# Altium project Cabinet.PrjPCB (part 1 of 2)
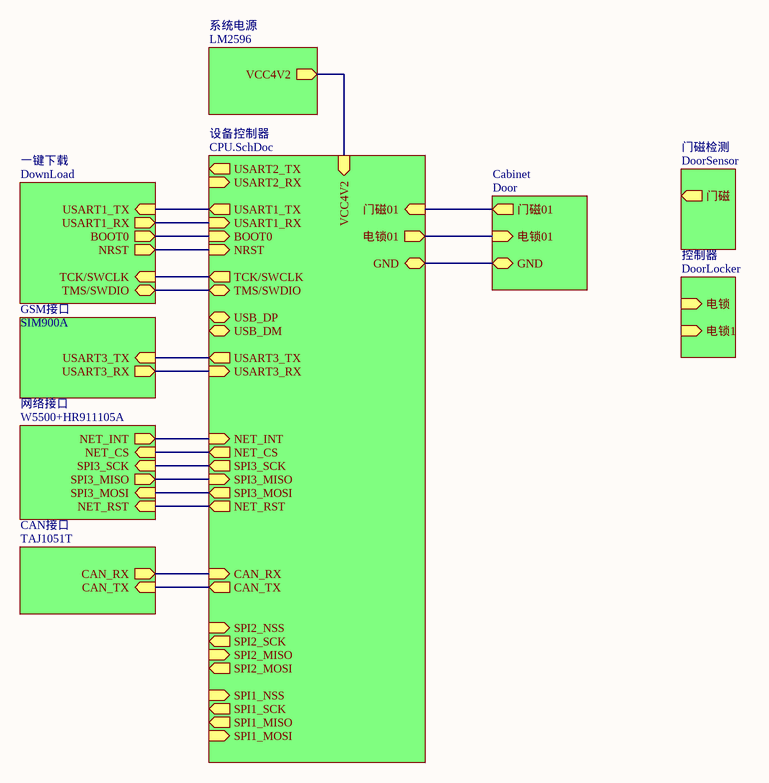
[diagram p0: Cabinet_device.SchDoc]
9 sheets, 160 parts. Net scope: hierarchical (ports join the sheet entries above them; power ports are global).
Sheets:
  Cabinet_device.SchDoc
    设备控制器 = CPU.SchDoc
    CAN接口 = TAJ1051T.SchDoc
    GSM接口 = SIM900A.SchDoc
    控制器 = DoorLocker.SchDoc
    网络接口 = W5500+HR911105A.SchDoc
    一键下载 = DownLoad.SchDoc
    系统电源 = LM2596.SchDoc
    Cabinet = Door.SchDoc

## Sheet Cabinet_device.SchDoc
size A4

### Sub-sheets
Cabinet = Door: 门磁01 (out), 电锁01 (in), GND
CAN接口 = TAJ1051T: CAN_RX (out), CAN_TX (in)
GSM接口 = SIM900A: USART3_RX (out), USART3_TX (in)
一键下载 = DownLoad: BOOT0 (out), NRST (out), USART1_TX (in), USART1_RX (out), TCK/SWCLK (in), TMS/SWDIO (bidir)
控制器 = DoorLocker: 电锁 (in), 电锁1 (in)
系统电源 = LM2596: VCC4V2 (out)
网络接口 = W5500+HR911105A: NET_CS (in), SPI3_MISO (out), SPI3_MOSI (in), SPI3_SCK (in), NET_RST (in), NET_INT (out)
设备控制器 = CPU.SchDoc: CAN_TX (out), CAN_RX (in), USART3_TX (out), USART3_RX (in), USART2_TX (out), USART2_RX (in), SPI1_NSS (in), SPI1_SCK (out), SPI1_MISO (out), SPI1_MOSI (in), USART1_TX (out), USART1_RX (in), 门磁01 (in), NET_CS (out), SPI2_SCK (out), SPI2_MISO (in), SPI2_MOSI (out), NET_RST (out), NET_INT (in), 电锁01 (out), USB_DM, USB_DP, TCK/SWCLK (out), TMS/SWDIO (bidir), VCC4V2 (in), BOOT0 (in), NRST (in), SPI3_SCK (out), SPI3_MISO (in), SPI3_MOSI (out), SPI2_NSS (in), GND
门磁检测 = DoorSensor (file not in this document): 门磁 (out)

### Nets
CAN_RX: sheet 设备控制器/CAN_RX, sheet CAN接口/CAN_RX
CAN_TX: sheet 设备控制器/CAN_TX, sheet CAN接口/CAN_TX
~{NRST}: sheet 设备控制器/NRST, sheet 一键下载/NRST
NetR28_1: sheet 设备控制器/NET_RST, sheet 网络接口/NET_RST
NetR29_2: sheet 设备控制器/NET_INT, sheet 网络接口/NET_INT
NetR30_2: sheet 设备控制器/NET_CS, sheet 网络接口/NET_CS
NetR52_1: sheet 设备控制器/BOOT0, sheet 一键下载/BOOT0
NetU7_16: sheet 设备控制器/门磁01, sheet Cabinet/门磁01
NetU7_47: sheet 设备控制器/USART3_TX, sheet GSM接口/USART3_TX
NetU7_48: sheet 设备控制器/USART3_RX, sheet GSM接口/USART3_RX
NetU7_68: sheet 设备控制器/USART1_TX, sheet 一键下载/USART1_TX
NetU7_69: sheet 设备控制器/USART1_RX, sheet 一键下载/USART1_RX
NetU7_72: sheet 设备控制器/TMS/SWDIO, sheet 一键下载/TMS/SWDIO
NetU7_76: sheet 设备控制器/TCK/SWCLK, sheet 一键下载/TCK/SWCLK
NetU7_82: sheet 设备控制器/电锁01, sheet Cabinet/电锁01
NetU7_89: sheet 设备控制器/SPI3_SCK, sheet 网络接口/SPI3_SCK
NetU7_90: sheet 设备控制器/SPI3_MISO, sheet 网络接口/SPI3_MISO
NetU7_91: sheet 设备控制器/SPI3_MOSI, sheet 网络接口/SPI3_MOSI
(unnamed): sheet 设备控制器/VCC4V2, sheet 系统电源/VCC4V2
(unnamed): sheet 设备控制器/GND, sheet Cabinet/GND

## Sheet CPU.SchDoc
size A3
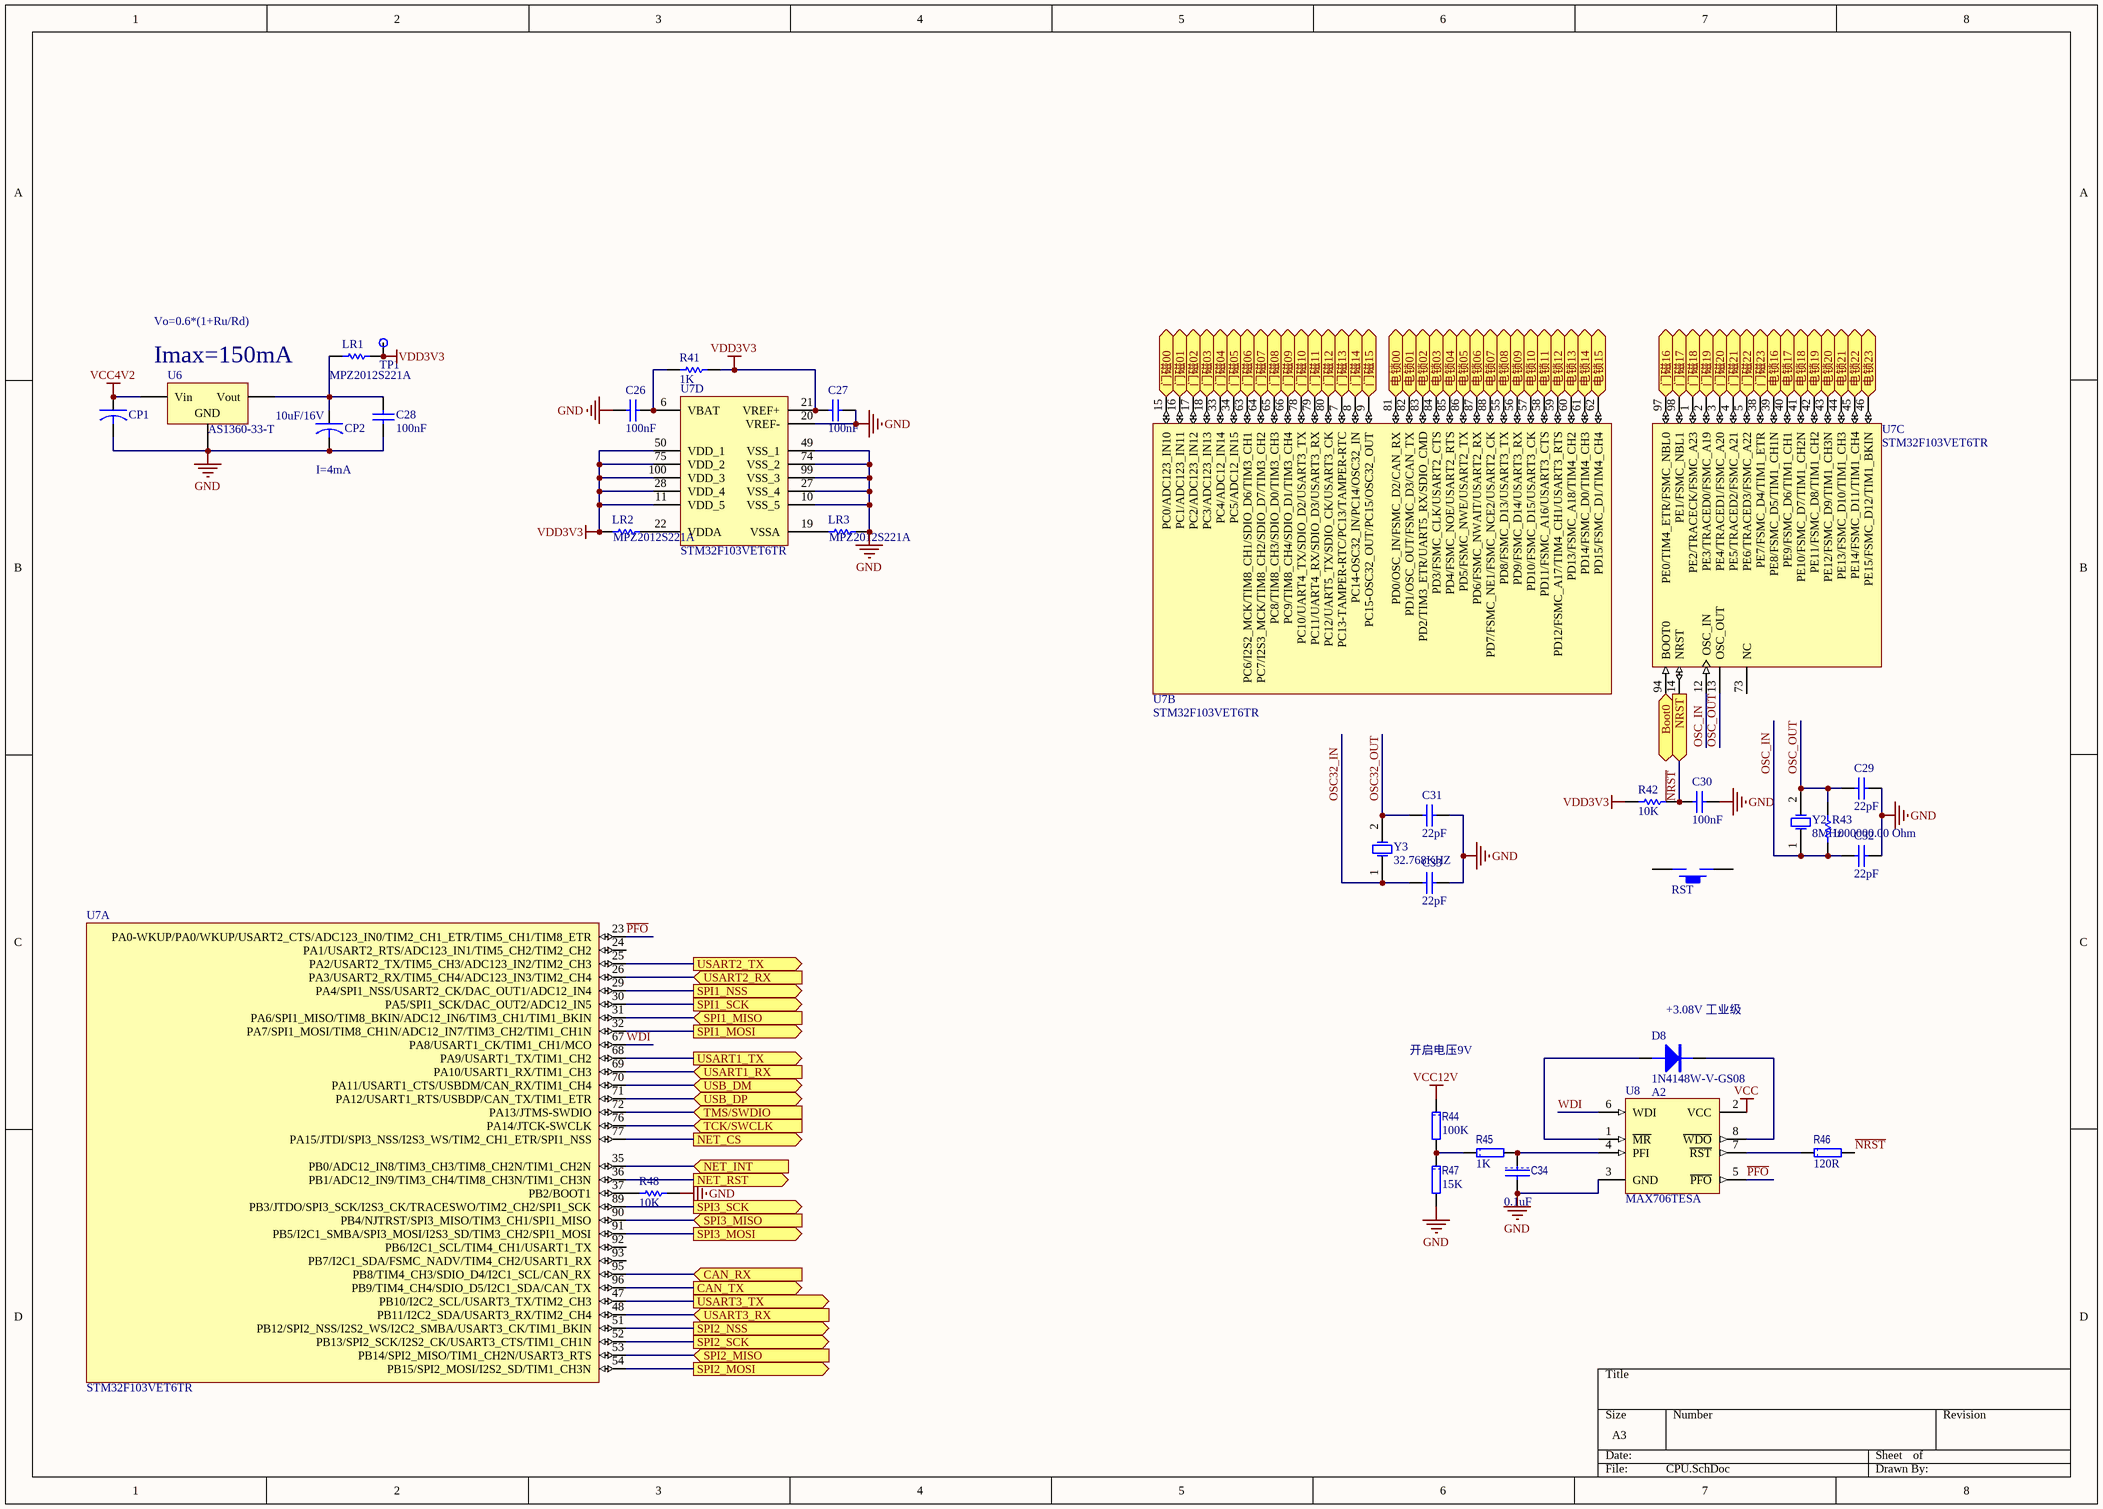
[diagram p1: CPU.SchDoc]

### Parts
(Parts that share a designator on the sheet are numbered #1, #2 ... from top to bottom, then left to right.)
C26  value 100nF  [CAPC0805(2012)100_L]  (hidden comment: CAP 100nF 50V 0805(2012))
C27  value 100nF  [CAPC0805(2012)100_L]  (hidden comment: CAP 100nF 50V 0805(2012))
C28  value 100nF  [CAPC0805(2012)100_L]  (hidden comment: CAP 100nF 50V 0805(2012))
C29  value 22pF  [CAPC0805(2012)75_M]  (hidden comment: CAP 22pF 50V 0805(2012))
C30  value 100nF  [CAPC0805(2012)145_N]  (hidden comment: CAP 100nF 50V 0805(2012))
C31  value 22pF  [CAPC0805(2012)75_M]  (hidden comment: CAP 22pF 50V 0805(2012))
C32  value 22pF  [CAPC0805(2012)75_M]  (hidden comment: CAP 22pF 50V 0805(2012))
C33  value 22pF  [CAPC0805(2012)75_M]  (hidden comment: CAP 22pF 50V 0805(2012))
C34  value 0.1uF  [1608[0603]C]  (hidden comment: C1608X7R1H104K)
CP1  TAJA106K016RNJ  [3216[1206]CB]  (value not drawn)
CP2  value 10uF/16V  [3216[1206]CB]  (hidden comment: TAJA106K016RNJ)
D8  1N4148W-V-GS08  value A2  [SOD123]
LR1  MPZ2012S221A  [2012[0805]]
LR2  MPZ2012S221A  [2012[0805]]
LR3  MPZ2012S221A  [2012[0805]]
R41  value 1K  [RESC0805(2012)_M]  (hidden comment: 1K 1% 0805(2012))
R42  value 10K  [RESC0805(2012)_M]  (hidden comment: 10K 1% 0805(2012))
R43  value 1000000.00 Ohm  [RESC0805(2012)_N]  (hidden comment: 1M 1% 0805(2012))
R44  value 100K  [1608[0603]R]  (hidden comment: CRCW0603100KFKEA)
R45  value 1K  [1608[0603]R]  (hidden comment: CRCW06031K00FKEA)
R46  value 120R  [1608[0603]R]  (hidden comment: CRCW0603120RFKEA)
R47  value 15K  [1608[0603]R]  (hidden comment: CRCW060315K0FKEA)
R48  value 10K  [RESC0805(2012)_M]  (hidden comment: 10K 1% 0805(2012))
RST  KEY_M  [KEY_M]  (value not drawn)
TP1  TP  [TP]  (value not drawn)
U6  AS1360-33-T  [SOT23_N]
U7  STM32F103VET6TR  [STM-LQFP100_M]  (parts A,B,C,D of 4)
U8#1  MAX706TESA  [NSO8_N]
Y2  8MHz  [XTAL_US]
Y3  32.768KHZ  [XTAL32_1]

### Ports
Boot0 (in), CAN_RX (in), CAN_TX (out), NET_CS (out), NET_INT (in), NET_RST (out), NRST (in), SPI1_MISO (in), SPI1_MOSI (out), SPI1_NSS (out), SPI1_SCK (out), SPI2_MISO (in), SPI2_MOSI (out), SPI2_NSS (out), SPI2_SCK (out), SPI3_MISO (in), SPI3_MOSI (out), SPI3_SCK (out), TCK/SWCLK (in), TMS/SWDIO (in), USART1_RX (in), USART1_TX (out), USART2_RX (in), USART2_TX (out), USART3_RX (in), USART3_TX (out), USB_DM (bidir), USB_DP (bidir), 电锁00 (out), 电锁01 (out), 电锁02 (out), 电锁03 (out), 电锁04 (out), 电锁05 (out), 电锁06 (out), 电锁07 (out), 电锁08 (out), 电锁09 (out), 电锁10 (out), 电锁11 (out), 电锁12 (out), 电锁13 (out), 电锁14 (out), 电锁15 (out), 电锁16 (out), 电锁17 (out), 电锁18 (out), 电锁19 (out), 电锁20 (out), 电锁21 (out), 电锁22 (out), 电锁23 (out), 门磁00 (in), 门磁01 (in), 门磁02 (in), 门磁03 (in), 门磁04 (in), 门磁05 (in), 门磁06 (in), 门磁07 (in), 门磁08 (in), 门磁09 (in), 门磁10 (in), 门磁11 (in), 门磁12 (in), 门磁13 (in), 门磁14 (in), 门磁15 (in), 门磁16 (in), 门磁17 (in), 门磁18 (in), 门磁19 (in), 门磁20 (in), 门磁21 (in), 门磁22 (in), 门磁23 (in)

### Nets
GND: C26.2 C27.2 C28.1 C29.1 C30.1 C31.1 C32.1 C33.1 C34.2 CP1.2 CP2.2 LR3.2 R47.2 R48.1 U6.1(GND) U7.10(VSS_5) U7.20(VREF-) U7.27(VSS_4) U7.49(VSS_1) U7.74(VSS_2) U7.99(VSS_3) U8#1.3(GND)
VCC: U8#1.2(VCC)
VCC4V2: CP1.1 U6.3(Vin)
VCC12V: R44.1
VDD3V3: C27.1 LR1.1 LR2.1 R41.1 R42.2 TP1.1(TestPoint) U7.11(VDD_5) U7.21(VREF+) U7.28(VDD_4) U7.50(VDD_1) U7.75(VDD_2) U7.100(VDD_3)
CAN_RX: U7.95(PB8/TIM4_CH3/SDIO_D4/I2C1_SCL/CAN_RX) ; port CAN_RX
CAN_TX: U7.96(PB9/TIM4_CH4/SDIO_D5/I2C1_SDA/CAN_TX) ; port CAN_TX
~{NRST}: C30.2 R42.1 R46.2 U7.14(NRST) ; port NRST
OSC32_IN: C33.2 Y3.1(OSC1)
OSC32_OUT: C31.2 Y3.2(OSC2)
OSC_IN: C32.2 R43.1 U7.12(OSC_IN) Y2.1(OSC1)
OSC_OUT: C29.2 R43.2 U7.13(OSC_OUT) Y2.2(OSC2)
~{PFO}: U7.23(PA0-WKUP/PA0/WKUP/USART2_CTS/ADC123_IN0/TIM2_CH1_ETR/TIM5_CH1/TIM8_ETR) U8#1.5(~{PFO})
WDI: U7.67(PA8/USART1_CK/TIM1_CH1/MCO) U8#1.6(WDI)
NetC26_1: C26.1 R41.2 U7.6(VBAT)
NetC28_2: C28.2 CP2.1 LR1.2 U6.2(Vout)
NetC34_1: C34.1 R45.2 U8#1.4(PFI)
NetD8_1: D8.1(A) U8#1.1(~{MR})
NetD8_2: D8.2(K) U8#1.8(~{WDO})
NetLR2_2: LR2.2 U7.22(VDDA)
NetLR3_1: LR3.1 U7.19(VSSA)
NetR28_1: U7.36(PB1/ADC12_IN9/TIM3_CH4/TIM8_CH3N/TIM1_CH3N) ; port NET_RST
NetR29_2: U7.35(PB0/ADC12_IN8/TIM3_CH3/TIM8_CH2N/TIM1_CH2N) ; port NET_INT
NetR30_2: U7.77(PA15/JTDI/SPI3_NSS/I2S3_WS/TIM2_CH1_ETR/SPI1_NSS) ; port NET_CS
NetR44_2: R44.2 R45.1 R47.1
NetR46_1: R46.1 U8#1.7(~{RST})
NetR48_2: R48.2 U7.37(PB2/BOOT1)
NetR52_1: U7.94(BOOT0) ; port Boot0
NetU7_1: U7.1(PE2/TRACECK/FSMC_A23) ; port 门磁18
NetU7_2: U7.2(PE3/TRACED0/FSMC_A19) ; port 门磁19
NetU7_3: U7.3(PE4/TRACED1/FSMC_A20) ; port 门磁20
NetU7_4: U7.4(PE5/TRACED2/FSMC_A21) ; port 门磁21
NetU7_5: U7.5(PE6/TRACED3/FSMC_A22) ; port 门磁22
NetU7_7: U7.7(PC13-TAMPER-RTC/PC13/TAMPER-RTC) ; port 门磁13
NetU7_8: U7.8(PC14-OSC32_IN/PC14/OSC32_IN) ; port 门磁14
NetU7_9: U7.9(PC15-OSC32_OUT/PC15/OSC32_OUT) ; port 门磁15
NetU7_15: U7.15(PC0/ADC123_IN10) ; port 门磁00
NetU7_16: U7.16(PC1/ADC123_IN11) ; port 门磁01
NetU7_17: U7.17(PC2/ADC123_IN12) ; port 门磁02
NetU7_18: U7.18(PC3/ADC123_IN13) ; port 门磁03
NetU7_25: U7.25(PA2/USART2_TX/TIM5_CH3/ADC123_IN2/TIM2_CH3) ; port USART2_TX
NetU7_26: U7.26(PA3/USART2_RX/TIM5_CH4/ADC123_IN3/TIM2_CH4) ; port USART2_RX
NetU7_29: U7.29(PA4/SPI1_NSS/USART2_CK/DAC_OUT1/ADC12_IN4) ; port SPI1_NSS
NetU7_30: U7.30(PA5/SPI1_SCK/DAC_OUT2/ADC12_IN5) ; port SPI1_SCK
NetU7_31: U7.31(PA6/SPI1_MISO/TIM8_BKIN/ADC12_IN6/TIM3_CH1/TIM1_BKIN) ; port SPI1_MISO
NetU7_32: U7.32(PA7/SPI1_MOSI/TIM8_CH1N/ADC12_IN7/TIM3_CH2/TIM1_CH1N) ; port SPI1_MOSI
NetU7_33: U7.33(PC4/ADC12_IN14) ; port 门磁04
NetU7_34: U7.34(PC5/ADC12_IN15) ; port 门磁05
NetU7_38: U7.38(PE7/FSMC_D4/TIM1_ETR) ; port 门磁23
NetU7_39: U7.39(PE8/FSMC_D5/TIM1_CH1N) ; port 电锁16
NetU7_40: U7.40(PE9/FSMC_D6/TIM1_CH1) ; port 电锁17
NetU7_41: U7.41(PE10/FSMC_D7/TIM1_CH2N) ; port 电锁18
NetU7_42: U7.42(PE11/FSMC_D8/TIM1_CH2) ; port 电锁19
NetU7_43: U7.43(PE12/FSMC_D9/TIM1_CH3N) ; port 电锁20
NetU7_44: U7.44(PE13/FSMC_D10/TIM1_CH3) ; port 电锁21
NetU7_45: U7.45(PE14/FSMC_D11/TIM1_CH4) ; port 电锁22
NetU7_46: U7.46(PE15/FSMC_D12/TIM1_BKIN) ; port 电锁23
NetU7_47: U7.47(PB10/I2C2_SCL/USART3_TX/TIM2_CH3) ; port USART3_TX
NetU7_48: U7.48(PB11/I2C2_SDA/USART3_RX/TIM2_CH4) ; port USART3_RX
NetU7_51: U7.51(PB12/SPI2_NSS/I2S2_WS/I2C2_SMBA/USART3_CK/TIM1_BKIN) ; port SPI2_NSS
NetU7_52: U7.52(PB13/SPI2_SCK/I2S2_CK/USART3_CTS/TIM1_CH1N) ; port SPI2_SCK
NetU7_53: U7.53(PB14/SPI2_MISO/TIM1_CH2N/USART3_RTS) ; port SPI2_MISO
NetU7_54: U7.54(PB15/SPI2_MOSI/I2S2_SD/TIM1_CH3N) ; port SPI2_MOSI
NetU7_55: U7.55(PD8/FSMC_D13/USART3_TX) ; port 电锁08
NetU7_56: U7.56(PD9/FSMC_D14/USART3_RX) ; port 电锁09
NetU7_57: U7.57(PD10/FSMC_D15/USART3_CK) ; port 电锁10
NetU7_58: U7.58(PD11/FSMC_A16/USART3_CTS) ; port 电锁11
NetU7_59: U7.59(PD12/FSMC_A17/TIM4_CH1/USART3_RTS) ; port 电锁12
NetU7_60: U7.60(PD13/FSMC_A18/TIM4_CH2) ; port 电锁13
NetU7_61: U7.61(PD14/FSMC_D0/TIM4_CH3) ; port 电锁14
NetU7_62: U7.62(PD15/FSMC_D1/TIM4_CH4) ; port 电锁15
NetU7_63: U7.63(PC6/I2S2_MCK/TIM8_CH1/SDIO_D6/TIM3_CH1) ; port 门磁06
NetU7_64: U7.64(PC7/I2S3_MCK/TIM8_CH2/SDIO_D7/TIM3_CH2) ; port 门磁07
NetU7_65: U7.65(PC8/TIM8_CH3/SDIO_D0/TIM3_CH3) ; port 门磁08
NetU7_66: U7.66(PC9/TIM8_CH4/SDIO_D1/TIM3_CH4) ; port 门磁09
NetU7_68: U7.68(PA9/USART1_TX/TIM1_CH2) ; port USART1_TX
NetU7_69: U7.69(PA10/USART1_RX/TIM1_CH3) ; port USART1_RX
NetU7_70: U7.70(PA11/USART1_CTS/USBDM/CAN_RX/TIM1_CH4) ; port USB_DM
NetU7_71: U7.71(PA12/USART1_RTS/USBDP/CAN_TX/TIM1_ETR) ; port USB_DP
NetU7_72: U7.72(PA13/JTMS-SWDIO) ; port TMS/SWDIO
NetU7_76: U7.76(PA14/JTCK-SWCLK) ; port TCK/SWCLK
NetU7_78: U7.78(PC10/UART4_TX/SDIO_D2/USART3_TX) ; port 门磁10
NetU7_79: U7.79(PC11/UART4_RX/SDIO_D3/USART3_RX) ; port 门磁11
NetU7_80: U7.80(PC12/UART5_TX/SDIO_CK/USART3_CK) ; port 门磁12
NetU7_81: U7.81(PD0/OSC_IN/FSMC_D2/CAN_RX) ; port 电锁00
NetU7_82: U7.82(PD1/OSC_OUT/FSMC_D3/CAN_TX) ; port 电锁01
NetU7_83: U7.83(PD2/TIM3_ETR/UART5_RX/SDIO_CMD) ; port 电锁02
NetU7_84: U7.84(PD3/FSMC_CLK/USART2_CTS) ; port 电锁03
NetU7_85: U7.85(PD4/FSMC_NOE/USART2_RTS) ; port 电锁04
NetU7_86: U7.86(PD5/FSMC_NWE/USART2_TX) ; port 电锁05
NetU7_87: U7.87(PD6/FSMC_NWAIT/USART2_RX) ; port 电锁06
NetU7_88: U7.88(PD7/FSMC_NE1/FSMC_NCE2/USART2_CK) ; port 电锁07
NetU7_89: U7.89(PB3/JTDO/SPI3_SCK/I2S3_CK/TRACESWO/TIM2_CH2/SPI1_SCK) ; port SPI3_SCK
NetU7_90: U7.90(PB4/NJTRST/SPI3_MISO/TIM3_CH1/SPI1_MISO) ; port SPI3_MISO
NetU7_91: U7.91(PB5/I2C1_SMBA/SPI3_MOSI/I2S3_SD/TIM3_CH2/SPI1_MOSI) ; port SPI3_MOSI
NetU7_97: U7.97(PE0/TIM4_ETR/FSMC_NBL0) ; port 门磁16
NetU7_98: U7.98(PE1/FSMC_NBL1) ; port 门磁17

Not connected (* = marked no-connect by the designer): RST 1 2; U7 24(PA1/USART2_RTS/ADC123_IN1/TIM5_CH2/TIM2_CH2) 73(NC) 92(PB6/I2C1_SCL/TIM4_CH1/USART1_TX) 93(PB7/I2C1_SDA/FSMC_NADV/TIM4_CH2/USART1_RX)

### Notes on the sheet
- (near U6) Imax=150mA
- Vo=0.6*(1+Ru/Rd)
- (near CP2) I=4mA
- 开启电压9V
- (near D8) +3.08V 工业级

### Library data of the parts
C26-C28 = CMP-1036-04418-1: CAP 100nF 50V ±5% 0805 (2012 Metric) Thickness 1mm SMD; Case-EIA: 0805; Case-Metric: 2012; Tolerance: ±5%; Max Thickness: 1 mm; Technology: SMT; Rated Voltage: 50 V
C29 C31-C33 = CMP-1036-01234-1: CAP 22pF 50V ±1% 0805 (2012 Metric) Thickness 0.75mm SMD; Case-EIA: 0805; Case-Metric: 2012; Rated Voltage: 50 V; Tolerance: ±1%; Technology: SMT; Max Thickness: 0.75 mm
C30 = CMP-1036-04417-1: CAP 100nF 50V ±5% 0805 (2012 Metric) Thickness 1.45mm SMD; Case-Metric: 2012; Case-EIA: 0805; Max Thickness: 1.45 mm; Tolerance: ±5%; Rated Voltage: 50 V; Technology: SMT
C34 = CAP: 多层陶瓷电容器MLCC - SMD/SMT 0603 0.1uF 50volts X7R 10%; Manufacturer: TDK; 产品: General Type MLCCs; 产品种类: Low & Medium Capacitance SMD Ceramic Chip Capacitors; 外壳代码 - in: 0603; 外壳代码 - mm: 1608; 封装 / 箱体: 0603 (1608 metric); 封装: Reel; 尺寸: 0.8 mm W x 1.6 mm L x 0.8 mm H; 工作温度范围: - 55 C to + 125 C; 标准包装数量: 4000; 电压额定值: 50 V; 电容-nF: 100 nF; 电容-pF: 100000 pF; 系列: C; Category: 多层陶瓷电容器MLCC - SMD/SMT; ComponentLink1Description: http://www.tdk.com/pdf/general_B11.pdf; ComponentLink1URL: http://www.tdk.com/pdf/general_B11.pdf; Description 1: 多层陶瓷电容器MLCC - SMD/SMT 0603 0.1uF 50volts X7R 10%; Manufacturer Part Number: C1608X7R1H104K; Minimum Order Quantity: 1; Pricing 1: 1=0.160, 50=0.070, 100=0.036, 500=0.019, 1000=0.013, 4000=0.010, 8000=0.009, 12000=0.008, 20000=0.007 (USD); Reeling: True; RoHS - 贸泽: Y; RoHS: RoHS Compliant; Stock 1: 224604; Supplier 1: Mouser; Supplier Part Number 1: 810-C1608X7R1H104K; 制造商: TDK; 容差: 10 %; 温度系数/代码: X7R; 电容: 0.1 uF; 端接类型: SMD/SMT
CP1 CP2 = CAPACITOR: 钽质电容器-固体SMD 16volts 10uF 10%; Manufacturer: AVX; ESR: 3 Ohms; 产品: Tantalum Solid Standard Grade - Other Various; 产品种类: SMD Tantalum Capacitors; 制造商库存号: A Case; 外壳代码 - in: 1206; 外壳代码 - mm: 3216; 封装 / 箱体: 1206 (3216 metric); 封装: Reel; 尺寸: 1.6 mm W x 3.2 mm L; 工作温度范围: - 55 C to + 125 C; 损耗因数 DF: 8; 标准包装数量: 2000; 漏泄电流: 1.6 uA; 电压额定值: 16 V; 端接类型: SMD/SMT; 系列: TAJ; 高度: 1.8 mm; Category: 钽质电容器-固体SMD; ComponentLink1Description: http://www.avx.com/docs/Catalogs/taj.pdf; ComponentLink1URL: http://www.avx.com/docs/Catalogs/taj.pdf; Description 1: 钽质电容器-固体SMD 16volts 10uF 10%; Manufacturer Part Number: TAJA106K016RNJ; Minimum Order Quantity: 1; Pricing 1: 1=0.600, 100=0.280, 200=0.250, 500=0.221, 1000=0.200, 2000=0.140, 5000=0.131, 10000=0.124, 25000=0.103 (USD); Reeling: True; RoHS - 贸泽: Y; RoHS: RoHS Compliant; Stock 1: 20335; Supplier 1: Mouser; Supplier Part Number 1: 581-TAJA106K016R; 制造商: AVX; 容差: 10 %; 电容: 10 uF
D8 = 1N4148W: 二极管 - 通用，功率，开关 100V Io/150mA; Manufacturer: Vishay Semiconductors; 配置: Single; 工作温度范围: - 65 C to + 150 C; 封装 / 箱体: SOD-123; 封装: Reel; 产品: Switching Diodes; 正向连续电流: 0.15 A; 最大浪涌电流: 0.5 A; 安装风格: SMD/SMT; 恢复时间: 4 ns; 正向电压下降: 1.2 V; 制造商: Vishay; 最大二极管电容: 4 pF; 最大工作温度: + 150 C; 最大功率耗散: 350 mW; 最大反向漏泄电流: 5 uA; 最小工作温度: - 65 C; 标准包装数量: 15000; Supplier 1: Mouser; Supplier Part Number 1: 625-1N4148W-V; Manufacturer Part Number: 1N4148W-V-GS08; RoHS: RoHS Compliant; Category: 二极管 - 通用，功率，开关; Stock 1: 404148; Pricing 1: 1=0.090, 10=0.083, 50=0.072, 100=0.068, 500=0.032, 1000=0.026, 3000=0.021, 9000=0.016, 10000=0.016, 18000=0.014 (USD); 峰值反向电压: 100 V; 产品种类: Switching Diodes; RoHS - 贸泽: Y; Minimum Order Quantity: 1; Reeling: True; ComponentLink1URL: http://www.mouser.com/ds/2/427/1n4148w--240387.pdf; ComponentLink1Description: http://www.mouser.com/ds/2/427/1n4148w--240387.pdf; Description 1: 二极管 - 通用，功率，开关 100V Io/150mA
LR1-LR3 = Res Semi: 电磁干扰滤波珠子、扼流圈和阵列 Ferrite Chip Beads; Manufacturer: TDK; 阻抗: 220 Ohms; 最大直流电流: 3 A; 最大直流电阻: 0.04 Ohms; 工作温度范围: - 55 C to + 125 C; 封装 / 箱体: 2012; 封装: Reel; 端接类型: SMD/SMT; 容差: 25 %; 产品种类: Ferrite Beads; 标准包装数量: 4000; Supplier 1: Mouser; Supplier Part Number 1: 810-MPZ2012S221A; Manufacturer Part Number: MPZ2012S221A; RoHS: RoHS Compliant; Description 1: 电磁干扰滤波珠子、扼流圈和阵列 Ferrite Chip Beads; Category: 电磁干扰滤波珠子、扼流圈和阵列; Stock 1: 26540; Pricing 1: 1=0.070, 50=0.060, 100=0.053, 500=0.040, 1000=0.035, 4000=0.031, 8000=0.029, 12000=0.025 (USD); 制造商: TDK; RoHS - 贸泽: Y; Minimum Order Quantity: 1; Reeling: True; ComponentLink1URL: http://www.mouser.com/ds/2/400/e9413_mpz-24582.pdf; ComponentLink1Description: http://www.mouser.com/ds/2/400/e9413_mpz-24582.pdf
R41 = CMP-1013-00510-1: 1K 0.125W 1% 0805 (2012 Metric)  SMD; Case-Metric: 2012; Case-EIA: 0805; Tolerance: 1 %; Power: 0.125 W; Technology: SMT
R42 R48 = CMP-1013-00623-1: 10K 0.125W 1% 0805 (2012 Metric)  SMD; Case-Metric: 2012; Case-EIA: 0805; Tolerance: 1 %; Power: 0.125 W; Technology: SMT
R43 = CMP-1013-00849-1: 1M 0.125W 1% 0805 (2012 Metric)  SMD; Case-Metric: 2012; Case-EIA: 0805; Technology: SMT; Power: 0.125 W; Tolerance: 1 %
R44 = RES: 厚膜电阻器 - SMD 1/10watt 100Kohms 1%; Manufacturer: Vishay / Dale; 尺寸: 0.85 mm W x 1.55 mm L x 0.45 mm H; 工作温度范围: - 55 C to + 155 C; 封装 / 箱体: 0603 (1608 metric); 封装: Reel; 功率额定值: 100 mW; 产品: Thick Film Resistors SMD; 系列: CRCW; 温度系数: 100 PPM / K; 端接类型: SMD/SMT; 电压额定值: 75 V; 制造商: Vishay; 产品种类: 0603 Thick Film Chip Resistors; 标准包装数量: 5000; 外壳代码 - in: 0603; 外壳代码 - mm: 1608; Supplier 1: Mouser; Supplier Part Number 1: 71-CRCW0603-100K-E3; Manufacturer Part Number: CRCW0603100KFKEA; RoHS: RoHS Compliant By Exemption; Category: 厚膜电阻器 - SMD; Stock 1: 175756; Pricing 1: 1=0.080, 10=0.013, 100=0.010, 1000=0.008, 5000=0.005, 25000=0.004, 50000=0.003 (USD); 电阻: 100 kOhms; 容差: 1 %; RoHS - 贸泽: E; Minimum Order Quantity: 1; Reeling: True; ComponentLink1URL: http://www.mouser.com/ds/2/427/dcrcwe3-109170.pdf; ComponentLink1Description: http://www.mouser.com/ds/2/427/dcrcwe3-109170.pdf; Description 1: 厚膜电阻器 - SMD 1/10watt 100Kohms 1%
R45 = RES: 厚膜电阻器 - SMD 1/10watt 1.0Kohms 1%; Manufacturer: Vishay / Dale; 尺寸: 0.85 mm W x 1.55 mm L x 0.45 mm H; 工作温度范围: - 55 C to + 155 C; 封装 / 箱体: 0603 (1608 metric); 封装: Reel; 功率额定值: 100 mW; 产品: Thick Film Resistors SMD; 电阻: 1 kOhms; 系列: CRCW; 温度系数: 100 PPM / K; 端接类型: SMD/SMT; 电压额定值: 75 V; 制造商: Vishay; 产品种类: 0603 Thick Film Chip Resistors; 标准包装数量: 5000; 外壳代码 - in: 0603; 外壳代码 - mm: 1608; Supplier 1: Mouser; Supplier Part Number 1: 71-CRCW0603-1.0K-E3; Manufacturer Part Number: CRCW06031K00FKEA; RoHS: RoHS Compliant By Exemption; Category: 厚膜电阻器 - SMD; Stock 1: 276938; Pricing 1: 1=0.080, 10=0.013, 100=0.010, 1000=0.008, 5000=0.005, 25000=0.004, 50000=0.003 (USD); 容差: 1 %; RoHS - 贸泽: E; Minimum Order Quantity: 1; Reeling: True; ComponentLink1URL: http://www.mouser.com/ds/2/427/dcrcwe3-109170.pdf; ComponentLink1Description: http://www.mouser.com/ds/2/427/dcrcwe3-109170.pdf; Description 1: 厚膜电阻器 - SMD 1/10watt 1.0Kohms 1%
R46 = RES: 厚膜电阻器 - SMD 1/10watt 120ohms 1%; Manufacturer: Vishay / Dale; 尺寸: 0.85 mm W x 1.55 mm L x 0.45 mm H; 工作温度范围: - 55 C to + 155 C; 封装 / 箱体: 0603 (1608 metric); 封装: Reel; 功率额定值: 100 mW; 产品: Thick Film Resistors SMD; 系列: CRCW; 温度系数: 100 PPM / K; 端接类型: SMD/SMT; 电压额定值: 75 V; 外壳代码 - in: 0603; 外壳代码 - mm: 1608; 制造商: Vishay; 产品种类: 0603 Thick Film Chip Resistors; 标准包装数量: 5000; Supplier 1: Mouser; Supplier Part Number 1: 71-CRCW0603-120-E3; Manufacturer Part Number: CRCW0603120RFKEA; RoHS: RoHS Compliant By Exemption; Category: 厚膜电阻器 - SMD; Stock 1: 11148; Pricing 1: 1=0.080, 10=0.013, 100=0.010, 1000=0.008, 5000=0.005, 25000=0.004, 50000=0.003 (USD); 电阻: 120 Ohms; 容差: 1 %; RoHS - 贸泽: E; Minimum Order Quantity: 1; Reeling: True; ComponentLink1URL: http://www.mouser.com/ds/2/427/dcrcwe3-109170.pdf; ComponentLink1Description: http://www.mouser.com/ds/2/427/dcrcwe3-109170.pdf; Description 1: 厚膜电阻器 - SMD 1/10watt 120ohms 1%
R47 = RES: 厚膜电阻器 - SMD 1/10watt 15Kohms 1%
TP1 = Test Point
U6 = Volt Reg: LDO Voltage Controllers; Manufacturer: ams; Input Voltage MAX: 20 V; Output Current: 150 mA; Output Voltage: 3.3 V; Product Status: New at Mouser; Supplier 1: Mouser; Supplier Part Number 1: 985-AS1360-33-T; Manufacturer Part Number: AS1360-33-T; RoHS: RoHS Compliant; Category: LDO Voltage Controllers; Stock 1: 4086; Pricing 1: 1=1.82, 10=1.46, 100=1.12, 500=0.991, 1000=0.783, 2500=0.730, 5000=0.695, 10000=0.680 (AUD); Package / Case: SOT-23-3; Packaging: Reel; Mounting Style: SMD/SMT; Maximum Operating Temperature: + 85 C; Minimum Operating Temperature: - 40 C; RoHS - Mouser: Y; Minimum Order Quantity: 1; Reeling: True; ComponentLink1URL: http://ams.com/eng/content/download/1325/7334/424; ComponentLink1Description: http://ams.com/eng/content/download/1325/7334/424
U7 = CMP-0237-00166-2: ARM Cortex-M3 32-bit MCU, 512 KB Flash, 64 KB Internal RAM, 80 I/Os, 100-pin LQFP, -40 to 85 degC, Tape and Reel; D/A Converter: 2x12-bit (2 Channel); I/Os (High Current): 80; Supply Voltage(Vcc) min (V): 2; Operating Frequency(F) (Processor speed) (MHz): 72; A/D Converter: 3x12-bit (16 Channel); FLASH Size (Prog) (kB): 512; Internal RAM Size (kB): 64; Mounting Technology: Surface Mount; ComponentLink2URL: http://www.st.com/st-web-ui/static/active/en/resource/technical/document/datasheet/CD00191185.pdf; ComponentLink1Description: Manufacturer URL; PackageReference: LQFP100; ComponentLink2Description: Datasheet; PackageVersion: Rev. 1, 06/2013; Core: ARM Cortex-M3; ComponentLink3URL: http://www.st.com/st-web-ui/static/active/en/resource/technical/document/data_brief/DM00071938.pdf; ComponentLink3Description: Package Specification; DatasheetVersion: Rev. 8; PartNumber: STM32F103VET6TR; Packing: Tape and Reel; ComponentLink1URL: http://www.st.com/web/en/home.html; PackageDescription: 100-Pin Low Profile Quad Flat Package, 14 x 14 mm Body, 0.5 mm Pitch
U8#1 = MAX706TESA: +3V Voltage Monitoring, Low-Cost, 礟 Supervisory Circuit; Published: 16-Jan-2001; LatestRevisionDate: 13-Apr-2006; LatestRevisionNote: IPC-7351 Footprint Added.; DatasheetVersion: Sep-1995; PackageReference: NSO8; Publisher: Altium Limited; PackageDescription: 8-Pin Small Outline Integrated Circuit 1.27 mm Pitch; Code_JEDEC: MS-012-AA; Code_IPC: SOIC127P600-8; ComponentLink1Description: Manufacturer Link; ComponentLink1URL: http://www.maxim-ic.com/; ComponentLink2Description: Datasheet; ComponentLink2URL: http://pdfserv.maxim-ic.com/en/ds/MAX706P-MAX708T.pdf
Y2 Y3 = XTAL: Crystal Oscillator; Published: 8-Jun-2000; LatestRevisionDate: 17-Jul-2002; LatestRevisionNote: Re-released for DXP Platform.; Publisher: Altium Limited

## Sheet TAJ1051T.SchDoc
size A4
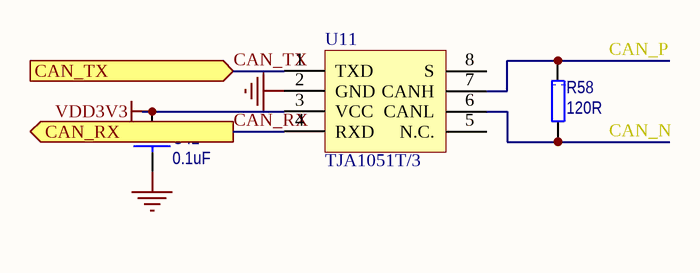
[diagram p2: TAJ1051T.SchDoc]

### Parts
C42  0.1uF  [1608[0603]]
R58  120R  [1608[0603]R]
U11  TJA1051T/3  [SOIC-SN8_N]

### Ports
CAN_RX (out), CAN_TX (in)

### Nets
GND: C42.2 U11.2(GND)
VDD3V3: C42.1 U11.3(VCC)
CAN_N: R58.2 U11.6(CANL)
CAN_P: R58.1 U11.7(CANH)
CAN_RX: U11.4(RXD) ; port CAN_RX
CAN_TX: U11.1(TXD) ; port CAN_TX

Not connected (* = marked no-connect by the designer): U11 5(N.C.) 8(S)

### Library data of the parts
C42 = CAP: Capacitor; Manufacturer: TDK; Type: 无铅电容; Model: C0603X7R1H104K; Value: 0.1uF
R58 = RES: Manufacturer: vishay; Model: RT0603DRD7D120RL; Value: 120R; Type: 无铅电阻
U11 = TJA1051T/3: IC; 公司: NXP

## Sheet SIM900A.SchDoc
size A4
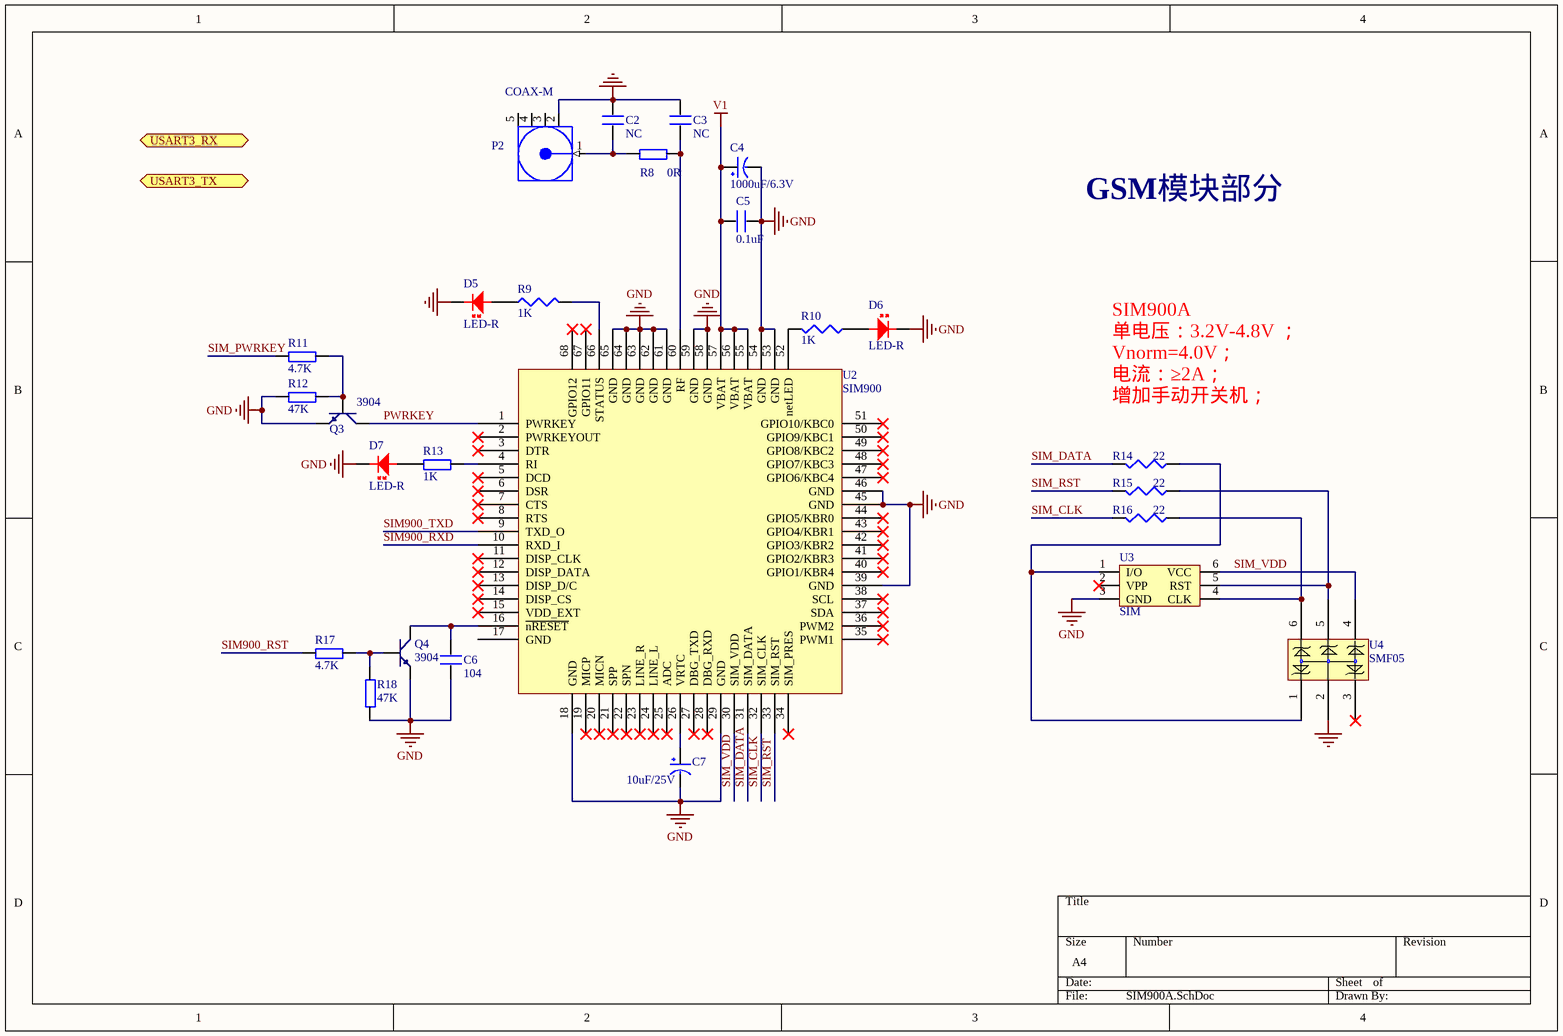
[diagram p3: SIM900A.SchDoc]

### Parts
C2  NC  [0805]
C3  NC  [0805]
C4  1000uF/6.3V  [7343]
C5  0.1uF  [0805]
C6  104  [0805]
C7  10uF/25V  [1206]
D5  LED-R  [LED-DIP]
D6  LED-R  [LED-DIP]
D7  LED-R  [LED-DIP]
P2  COAX-M  [ST-TH1]
Q3  3904  [SOT-23R]
Q4  3904  [SOT-23R]
R8  0R  [0603]
R9  1K  [0805]
R10  1K  [0805]
R11  4.7K  [0805]
R12  47K  [0805]
R13  1K  [0805]
R14  22  [0805]
R15  22  [0805]
R16  22  [0805]
R17  4.7K  [0805]
R18  47K  [0805]
U2  SIM900  [SIM-900]
U3  SIM  [sim-6p]
U4  SMF05  [SC70-6L]

### Ports
USART3_RX (out), USART3_TX (in)

### Nets
GND: C2.2 C3.2 C4.2(GND) C5.2 C6.1 C7.2(GND) D5.2 D6.2 D7.2 P2.2(GND) Q3.1(E) Q4.1(E) R12.1 R18.1 U2.18(GND) U2.29(GND) U2.39(GND) U2.45(GND) U2.46(GND) U2.53(GND) U2.54(GND) U2.58(GND) U2.59(GND) U2.61(GND) U2.62(GND) U2.63(GND) U2.64(GND) U2.65(GND) U3.3(GND) U4.2
V1: C4.1(VCC) C5.1 U2.55(VBAT) U2.56(VBAT) U2.57(VBAT)
PWRKEY: Q3.3(C) U2.1(PWRKEY)
SIM900_RST: R17.1
SIM900_RXD: U2.10(RXD_I)
SIM900_TXD: U2.9(TXD_O)
SIM_CLK: R16.2 U2.32(SIM_CLK)
SIM_DATA: R14.2 U2.31(SIM_DATA)
SIM_PWRKEY: R11.1
SIM_RST: R15.2 U2.33(SIM_RST)
SIM_VDD: U2.30(SIM_VDD) U3.6(VCC) U4.4
NetC2_1: C2.1 P2.1(Signal) R8.1
NetC3_1: C3.1 R8.2 U2.60(RF)
NetC6_2: C6.2 Q4.3(C) U2.16(~{nRESET})
NetC7_1: C7.1(VCC) U2.26(VRTC)
NetD5_1: D5.1 R9.1
NetD6_1: D6.1 R10.1
NetD7_1: D7.1 R13.1
NetQ3_2: Q3.2(B) R11.2 R12.2
NetQ4_2: Q4.2(B) R17.2 R18.2
NetR9_2: R9.2 U2.66(STATUS)
NetR10_2: R10.2 U2.52(netLED)
NetR13_2: R13.2 U2.4(RI)
NetR14_1: R14.1 U3.1(I/O) U4.1
NetR15_1: R15.1 U3.5(RST) U4.5
NetR16_1: R16.1 U3.4(CLK) U4.6

Not connected (* = marked no-connect by the designer): P2 3(GND) 4(GND) 5(GND); U2 2(PWRKEYOUT)* 3(DTR)* 5(DCD)* 6(DSR)* 7(CTS)* 8(RTS)* 11(DISP_CLK)* 12(DISP_DATA)* 13(DISP_D/C)* 14(DISP_CS)* 15(VDD_EXT)* 17(GND) 19(MICP)* 20(MICN)* 21(SPP)* 22(SPN)* 23(LINE_R)* 24(LINE_L)* 25(ADC)* 27(DBG_TXD)* 28(DBG_RXD)* 34(SIM_PRES)* 35(PWM1)* 36(PWM2)* 37(SDA)* 38(SCL)* 40(GPIO1/KBR4)* 41(GPIO2/KBR3)* 42(GPIO3/KBR2)* 43(GPIO4/KBR1)* 44(GPIO5/KBR0)* 47(GPIO6/KBC4)* 48(GPIO7/KBC3)* 49(GPIO8/KBC2)* 50(GPIO9/KBC1)* 51(GPIO10/KBC0)* 67(GPIO11)* 68(GPIO12)*; U3 2(VPP)*; U4 3*

### Notes on the sheet
- GSM模块部分
- (near R14) SIM900A
  单电压：3.2V-4.8V ；
  Vnorm=4.0V；
  电流：≥2A；
  增加手动开关机；

### Library data of the parts
C2 C3 C5 C6 = C
C4 C7 = CAP
D5-D7 = LED-RED: 红色LED
P2 = COAX-M: SMA-J-P-H-ST-TH1; PackageDocument: Rev. A, 16-Jun-1997; PCB_Layout: Complies with manufacturer's recommendation.; DrillSize: Corresponds to nominal value.; Published: 15-Jul-2004; LatestRevisionDate: 15-Jul-2004; LatestRevisionNote: Component Replaced.; DatasheetDocument: 30-May-2003; PackageReference: 908-21103; Publisher: Altium Limited; ComponentLink1Description: Manufacturer Link; ComponentLink1URL: http://www.amphenolrf.com/
Q3 Q4 = NPN: 8050/BCW846/BCW847
R8 R11-R13 R17 R18 = Res
R9 R10 R14-R16 = RES1
U3 = SIM: 手机SIM卡

## Sheet DoorLocker.SchDoc
size A4
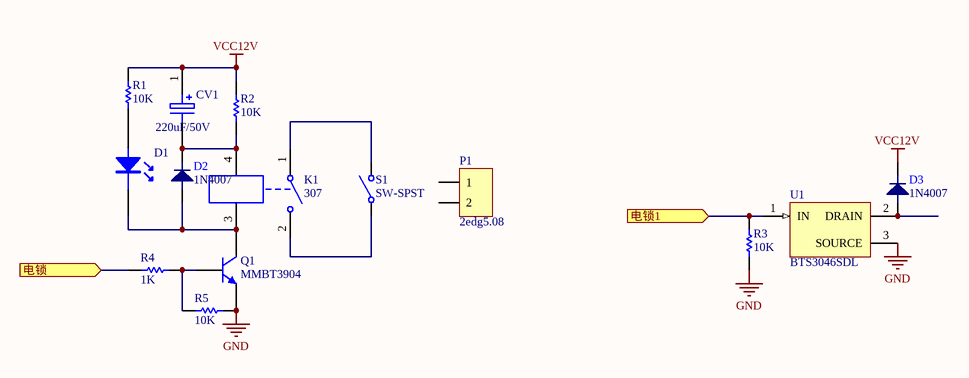
[diagram p4: DoorLocker.SchDoc]

### Parts
CV1  220uF/50V  [CAPPR5-10x20/H1.1]
D1  (no value)  [0805-L]
D2  1N4007  [DO-214AC(SMA)]
D3  1N4007  [DO-214AC(SMA)]
K1  307  [RELAY-SONGCHUAN]
P1  2edg5.08  [2edg5.08_2]
Q1  MMBT3904  [SOT23_N]
R1  value 10K  [RESC0805(2012)_M]  (hidden comment: 10K 1% 0805(2012))
R2  value 10K  [RESC0805(2012)_M]  (hidden comment: 10K 1% 0805(2012))
R3  value 10K  [RESC0805(2012)_M]  (hidden comment: 10K 1% 0805(2012))
R4  value 1K  [RESC0805(2012)_M]  (hidden comment: 1K 1% 0805(2012))
R5  value 10K  [RESC0805(2012)_M]  (hidden comment: 10K 1% 0805(2012))
S1  SW-SPST  [SPST-2]
U1  BTS3046SDL  [INF-PG-TO252-3-11_M]

### Ports
电锁1 (in), 电锁 (in)

### Nets
GND: Q1.2(E) R3.2 R5.1 U1.3(SOURCE)
VCC12V: CV1.1 D3.2 R1.1 R2.1
NetCV1_2: CV1.2 D2.2 K1.4 R2.2
NetD1_1: D1.1 R1.2
NetD1_2: D1.2 D2.1 K1.3 Q1.3(C)
NetD3_1: D3.1 U1.2(DRAIN)
NetK1_1: K1.1 S1.2(NO)
NetK1_2: K1.2 S1.1(COMMON)
NetQ1_1: Q1.1(B) R4.1 R5.2
NetR3_1: R3.1 U1.1(IN) ; port 电锁1
NetR4_2: R4.2 ; port 电锁

Not connected (* = marked no-connect by the designer): P1 1 2

### Library data of the parts
CV1 = ELECTRO1: aluminum electrolytic capacitor; Manufacturer: Yageo; Value: 220uF; Model: SL050K0220A5S-1019; Parameter: 220uF/50V
D1 = LED
D2 D3 = 1N4007: 1A整流二极管
K1 = JDQ_307: 继电器
P1 = 2EDG5.08_2: 端子
Q1 = MMBT3904: NPN Switching Transistor; Published: 17-Sep-2003; LatestRevisionDate: 12-Dec-2006; LatestRevisionNote: IPC-7351 Footprint Added.; DatasheetVersion: 13-May-2002; PackageVersion: May-1999; PackageReference: SOT23; Publisher: Altium Limited; PackageDescription: 3-Pin SOT-23 Package 0.95 mm Pitch, 2.3 mm Lead Span; ComponentLink1Description: Manufacturer Link; ComponentLink1URL: http://www.semiconductors.philips.com/; ComponentLink2Description: Datasheet; ComponentLink2URL: http://www.semiconductors.philips.com/acrobat/datasheets/MMBT3904_4.pdf
R1-R3 R5 = CMP-1013-00623-1: as R42 on sheet CPU; Tolerance: 1 %; Power: 0.125 W; Technology: SMT
R4 = CMP-1013-00510-1: as R41 on sheet CPU; Tolerance: 1 %; Power: 0.125 W; Technology: SMT
S1 = SW-SPST: Single-Pole, Single-Throw Switch; Published: 24-Mar-1999; LatestRevisionDate: 17-Jul-2002; LatestRevisionNote: Re-released for DXP Platform.; PackageReference: SPST-2; Publisher: Altium Limited
U1 = CMP-1137-00025-1: HITFET 46 mOhm Single Channel Smart Low Side Power Switch for12 V & 24 V Application, 60 V VDS, 3.6 A ID, -40 to 150 degC, PG-TO252-3-11, Reel, Green; Manufacturer: Infineon; toff (max): 120 us; ton (max): 100 us; ID(lim) (min): 10 A; Channels: 1; RDS (on)(max): 50 mOhm; Green: TRUE; ID(nom): 3.6 A; VDS (max): 60 V; PackageDescription: 3-Pin Plastic (Green) Transistor Single Outline Package, 6.5 x 6.12 mm Body, 2.28 mm Pitch; PackageVersion: Dec-06; ComponentLink2URL: http://www.infineon.com/dgdl/BTS3046SDL_DS_10.pdf?folderId=db3a3043163797a6011667aa084c0e01&fileId=db3a304325afd6e001263232a5146438&location=en.Products.Automotive_ICs.Smart_High-_and_Low-Side_Switches.HITFET___TEMPFET__-_Smart_Low-Side_Switches.DATASHEET.; Halogen-free: TRUE; ComponentLink3Description: Package Specification; DatasheetVersion: Rev. 1.0; ComponentLink1Description: Manufacturer URL; PackageReference: PG-TO252-3-11; ComponentLink1URL: http://www.infineon.com/; PartNumber: BTS3046SDL; Packing: Reel; ID: 3.6 A; Mounting Technology: Surface Mount; Group: HITFET; ComponentLink2Description: Datasheet; ComponentLink3URL: http://www.infineon.com/dgdl/BTS142_DS_13.pdf?folderId=db3a3043163797a6011667aa084c0e01&fileId=db3a3043163797a6011667ac98be0e02&location=en.Products.Automotive_ICs.Smart_High-_and_Low-Side_Switches.HITFET___TEMPFET__-_Smart_Low-Side_Switches.DATASHEET.BTS1

## Sheet W5500+HR911105A.SchDoc
size A4
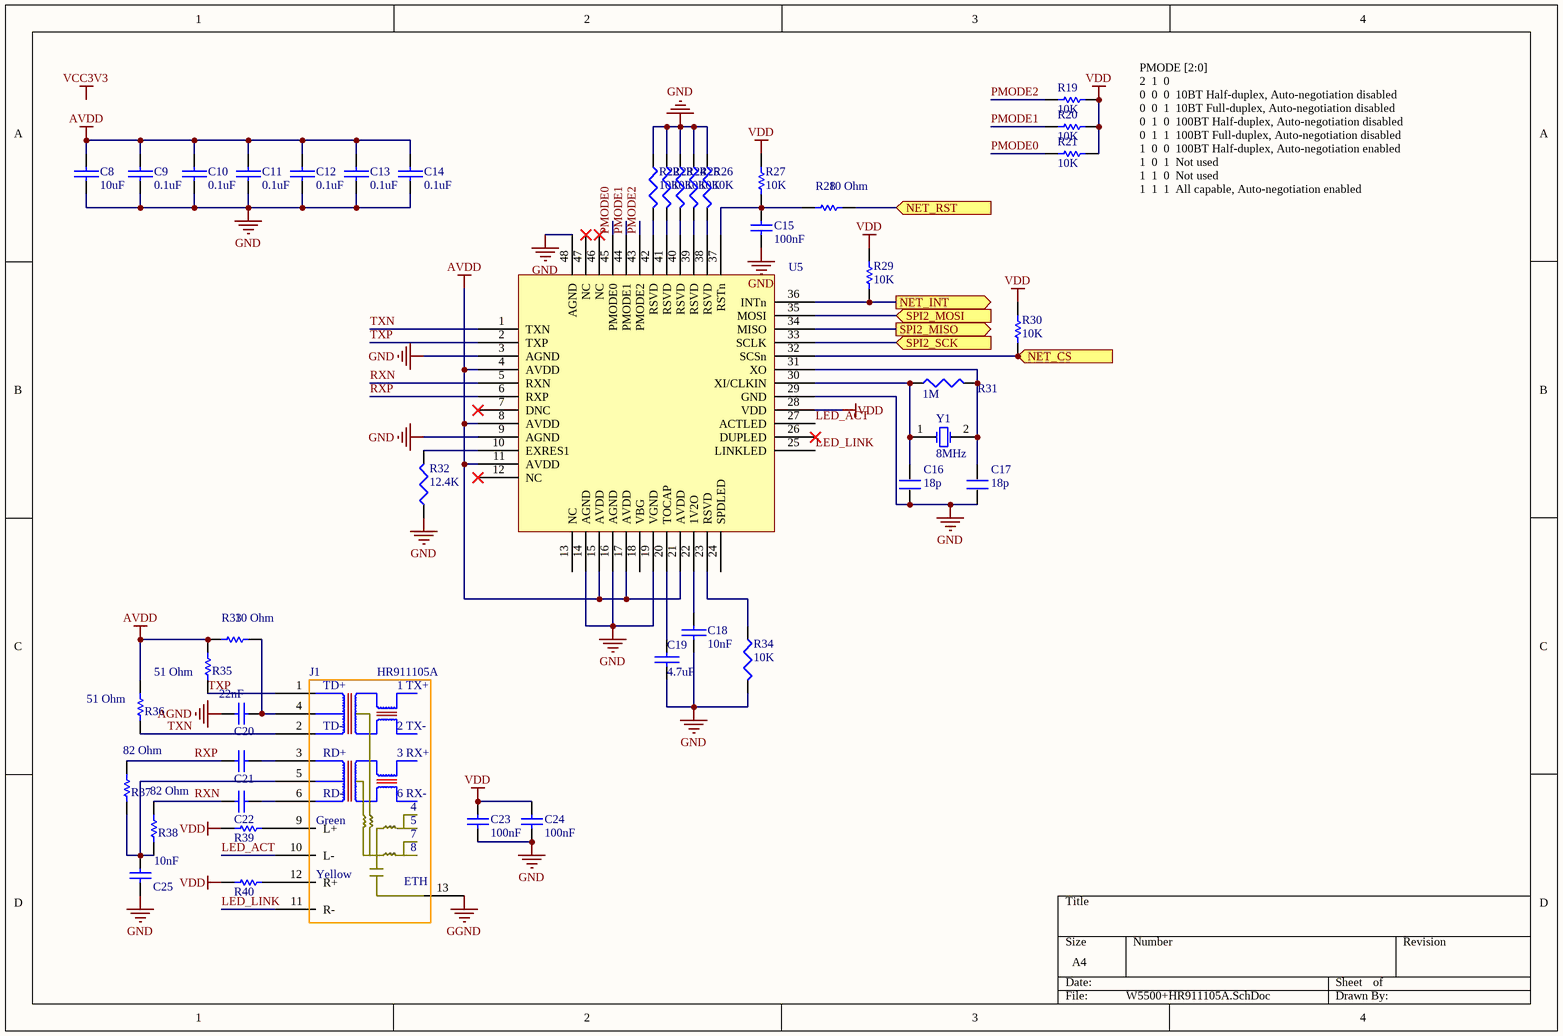
[diagram p5: W5500+HR911105A.SchDoc]

### Parts
C8  10uF  [0805]
C9  0.1uF  [0603]
C10  0.1uF  [0603]
C11  0.1uF  [0603]
C12  0.1uF  [0603]
C13  0.1uF  [0603]
C14  0.1uF  [0603]
C15  value 100nF  [CAPC0805(2012)145_N]  (hidden comment: CAP 100nF 50V 0805(2012))
C16  18p  [0603]
C17  18p  [0603]
C18  10nF  [0603]
C19  4.7uF  [0603]
C20  value 22nF  [CAPC0805(2012)130_N]  (hidden comment: CAP 22nF 50V 0805(2012))
C21  CAP 6.8nF 50V 0805(2012)  [CAPC0805(2012)100_L]  (value not drawn)
C22  CAP 6.8nF 50V 0805(2012)  [CAPC0805(2012)100_L]  (value not drawn)
C23  value 100nF  [CAPC0805(2012)100_L]  (hidden comment: CAP 100nF 50V 0805(2012))
C24  value 100nF  [CAPC0805(2012)100_L]  (hidden comment: CAP 100nF 50V 0805(2012))
C25  value 10nF  [CAPC0805(2012)100_M]  (hidden comment: CAP 10nF 50V 0805(2012))
J1  HR911105A  [HR911102]
R19  value 10K  [RESC0805(2012)_M]  (hidden comment: 10K 1% 0805(2012))
R20  value 10K  [RESC0805(2012)_M]  (hidden comment: 10K 1% 0805(2012))
R21  value 10K  [RESC0805(2012)_M]  (hidden comment: 10K 1% 0805(2012))
R22  10K  [0603]
R23  10K  [0603]
R24  10K  [0603]
R25  10K  [0603]
R26  10K  [0603]
R27  value 10K  [RESC0805(2012)_M]  (hidden comment: 10K 1% 0805(2012))
R28  value 10 Ohm  [RESC0805(2012)_L]  (hidden comment: 10R 5% 0805(2012))
R29  value 10K  [RESC0805(2012)_M]  (hidden comment: 10K 1% 0805(2012))
R30  value 10K  [RESC0805(2012)_M]  (hidden comment: 10K 1% 0805(2012))
R31  1M  [0603]
R32  12.4K  [0603]
R33  value 10 Ohm  [RESC0805(2012)_L]  (hidden comment: 10R 5% 0805(2012))
R34  10K  [0603]
R35  value 51 Ohm  [RESC0805(2012)_N]  (hidden comment: 51R 5% 0805(2012))
R36  value 51 Ohm  [RESC0805(2012)_N]  (hidden comment: 51R 5% 0805(2012))
R37  value 82 Ohm  [RESC0805(2012)_L]  (hidden comment: 82R 5% 0805(2012))
R38  value 82 Ohm  [RESC0805(2012)_L]  (hidden comment: 82R 5% 0805(2012))
R39  270R 5% 0805(2012)  [RESC0805(2012)_N]  (value not drawn)
R40  270R 5% 0805(2012)  [RESC0805(2012)_N]  (value not drawn)
U5  W5500  [LQFP48_N]  (value not drawn)
Y1  8MHz  [XTAL_US]

### Ports
NET_CS (in), NET_INT (out), NET_RST (in), SPI2_MISO (out), SPI2_MOSI (in), SPI2_SCK (in)

### Nets
AGND: C20.1
AVDD: C8.2 C9.1 C10.1 C11.1 C12.1 C13.1 C14.1 R33.2 R35.2 R36.2 U5.4(AVDD) U5.8(AVDD) U5.11(AVDD) U5.15(AVDD) U5.17(AVDD) U5.21(AVDD)
GGND: J1.13
GND: C8.1 C9.2 C10.2 C11.2 C12.2 C13.2 C14.2 C15.1 C16.1 C17.1 C18.2 C19.1 C23.1 C24.1 C25.1 R22.1 R23.1 R24.1 R25.1 R26.1 R32.1 R34.2 U5.3(AGND) U5.9(AGND) U5.14(AGND) U5.16(AGND) U5.19(VGND) U5.29(GND) U5.48(AGND)
VDD: C23.2 C24.2 R19.1 R20.1 R21.1 R27.1 R29.1 R30.1 R39.1 R40.1 U5.28(VDD)
LED_ACT: J1.10(L-) U5.27(ACTLED)
LED_LINK: J1.11(R-) U5.25(LINKLED)
PMODE0: R21.2 U5.45(PMODE0)
PMODE1: R20.2 U5.44(PMODE1)
PMODE2: R19.2 U5.43(PMODE2)
RXN: C22.1 R38.2 U5.5(RXN)
RXP: C21.1 R37.2 U5.6(RXP)
TXN: J1.2 R36.1 U5.1(TXN)
TXP: J1.1 R35.1 U5.2(TXP)
NetC15_2: C15.2 R27.2 R28.2 U5.37(RSTn)
NetC16_2: C16.2 R31.1 U5.30(XI/CLKIN) Y1.1(OSC1)
NetC17_2: C17.2 R31.2 U5.31(XO) Y1.2(OSC2)
NetC18_1: C18.1 U5.22(1V2O)
NetC19_2: C19.2 U5.20(TOCAP)
NetC20_2: C20.2 J1.4 R33.1
NetC21_2: C21.2 J1.3
NetC22_2: C22.2 J1.6
NetC25_2: C25.2 J1.5 R37.1 R38.1
NetJ1_9: J1.9(L+) R39.2
NetJ1_12: J1.12(R+) R40.2
NetR22_2: R22.2 U5.42(RSVD)
NetR23_2: R23.2 U5.41(RSVD)
NetR24_2: R24.2 U5.40(RSVD)
NetR25_2: R25.2 U5.39(RSVD)
NetR26_2: R26.2 U5.38(RSVD)
NetR28_1: R28.1 ; port NET_RST
NetR29_2: R29.2 U5.36(INTn) ; port NET_INT
NetR30_2: R30.2 U5.32(SCSn) ; port NET_CS
NetR32_2: R32.2 U5.10(EXRES1)
NetR34_1: R34.1 U5.23(RSVD)
NetU5_33: U5.33(SCLK) ; port SPI2_SCK
NetU5_34: U5.34(MISO) ; port SPI2_MISO
NetU5_35: U5.35(MOSI) ; port SPI2_MOSI

Not connected (* = marked no-connect by the designer): U5 7(DNC)* 12(NC)* 13(NC) 18(VBG) 24(SPDLED) 26(DUPLED)* 46(NC)* 47(NC)*

### Notes on the sheet
- PMODE [2:0]
  2  1  0
  0  0  0  10BT Half-duplex, Auto-negotiation disabled
  0  0  1  10BT Full-duplex, Auto-negotiation disabled
  0  1  0  100BT Half-duplex, Auto-negotiation disabled
  0  1  1  100BT Full-duplex, Auto-negotiation disabled
  1  0  0  100BT Half-duplex, Auto-negotiation enabled
  1  0  1  Not used
  1  1  0  Not used
  1  1  1  All capable, Auto-negotiation enabled
- Labels drawn without touching a wire or pin: VCC3V3
- (in symbol HR911102) TD+; 1 TX+; TD-; 2 TX-; RD+; 3 RX+; RD-; 6 RX-; Green; 7; 8; Yellow; ETH

### Library data of the parts
C8 C19 = CAP: 0.1uF
C9-C14 C18 = CAP
C15 = CMP-1036-04417-1: as C30 on sheet CPU; Max Thickness: 1.45 mm; Tolerance: ±5%; Rated Voltage: 50 V; Technology: SMT
C16 C17 = C
C20 = CMP-1036-04061-1: CAP 22nF 50V ±5% 0805 (2012 Metric) Thickness 1.2mm SMD; Case-Metric: 2012; Case-EIA: 0805; Max Thickness: 1.2 mm; Rated Voltage: 50 V; Technology: SMT; Tolerance: ±5%
C21 C22 = CMP-1036-03703-1: CAP 6.8nF 50V ±1% 0805 (2012 Metric) Thickness 1mm SMD; Case-Metric: 2012; Case-EIA: 0805; Value: 6.8nF; Tolerance: ±1%; Max Thickness: 1 mm; Technology: SMT; Rated Voltage: 50 V
C23 C24 = CMP-1036-04418-1: as C26 on sheet CPU; Tolerance: ±5%; Max Thickness: 1 mm; Technology: SMT; Rated Voltage: 50 V
C25 = CMP-1036-03837-1: CAP 10nF 50V ±1% 0805 (2012 Metric) Thickness 1mm SMD; Case-Metric: 2012; Case-EIA: 0805; Tolerance: ±1%; Rated Voltage: 50 V; Max Thickness: 1 mm; Technology: SMT
J1 = HR911102
R19-R21 R27 R29 R30 = CMP-1013-00623-1: as R42 on sheet CPU; Tolerance: 1 %; Power: 0.125 W; Technology: SMT
R22-R26 R31 R32 R34 = RES1
R28 R33 = CMP-1013-00026-1: 10R 0.125W 5% 0805 (2012 Metric)  SMD; Case-EIA: 0805; Case-Metric: 2012; Technology: SMT; Power: 0.125 W; Tolerance: 5 %
R35 R36 = CMP-1013-00043-1: 51R 0.125W 5% 0805 (2012 Metric)  SMD; Case-Metric: 2012; Case-EIA: 0805; Technology: SMT; Tolerance: 5 %; Power: 0.125 W
R37 R38 = CMP-1013-00048-1: 82R 0.125W 5% 0805 (2012 Metric)  SMD; Case-EIA: 0805; Case-Metric: 2012; Power: 0.125 W; Tolerance: 5 %; Technology: SMT
R39 R40 = CMP-1013-00060-1: 270R 0.125W 5% 0805 (2012 Metric)  SMD; Value: 270.00 Ohm; Case-Metric: 2012; Case-EIA: 0805; Power: 0.125 W; Technology: SMT; Tolerance: 5 %
U5 = W5500: 以太网
Y1 = XTAL: Crystal Oscillator; Published: 8-Jun-2000; LatestRevisionDate: 17-Jul-2002; LatestRevisionNote: Re-released for DXP Platform.; Publisher: Altium Limited

## Sheet DownLoad.SchDoc
size A4
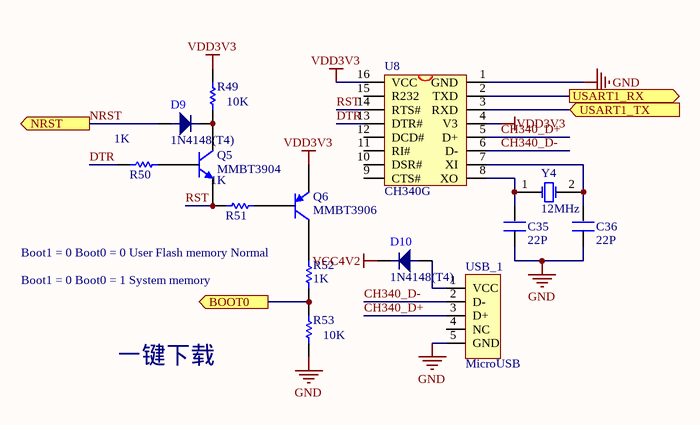
[diagram p6: DownLoad.SchDoc]

### Parts
(Parts that share a designator on the sheet are numbered #1, #2 ... from top to bottom, then left to right.)
C35  22P  [0805-CAP]
C36  22P  [0805-CAP]
D9  1N4148(T4)  [SOD-123]
D10  1N4148(T4)  [SOD-123]
Q5  MMBT3904  [SOT23_N]
Q6  MMBT3906  [SOT23_N]
R49  value 10K  [RESC0805(2012)_M]  (hidden comment: 10K 1% 0805(2012))
R50  value 1K  [RESC0805(2012)_M]  (hidden comment: 1K 1% 0805(2012))
R51  value 1K  [RESC0805(2012)_M]  (hidden comment: 1K 1% 0805(2012))
R52  value 1K  [RESC0805(2012)_M]  (hidden comment: 1K 1% 0805(2012))
R53  value 10K  [RESC0805(2012)_M]  (hidden comment: 10K 1% 0805(2012))
U8#2  CH340G  [SOP16M]
USB_1  MicroUSB  [USB_micro]
Y4  12MHz  [XTAL_US]

### Ports
BOOT0 (out), NRST (out), USART1_RX (out), USART1_TX (in)

### Nets
GND: C35.1 C36.1 R53.1 U8#2.1(GND) USB_1.5(GND)
VCC4V2: D10.2
VDD3V3: Q6.2(E) R49.2 U8#2.4(V3) U8#2.16(VCC)
CH340_D+: U8#2.5(D+) USB_1.3(D+)
CH340_D-: U8#2.6(D-) USB_1.2(D-)
DTR: R50.1 U8#2.13(DTR#)
NRST: D9.1 ; port NRST  [project net ~{NRST}]
RST: Q5.2(E) R51.1 U8#2.14(RTS#)
NetC35_2: C35.2 U8#2.8(XO) Y4.1(OSC1)
NetC36_2: C36.2 U8#2.7(XI) Y4.2(OSC2)
NetD9_2: D9.2 Q5.3(C) R49.1
NetD10_1: D10.1 USB_1.1(VCC)
NetQ5_1: Q5.1(B) R50.2
NetQ6_1: Q6.1(B) R51.2
NetQ6_3: Q6.3(C) R52.2
NetR52_1: R52.1 R53.2 ; port BOOT0
NetU7_68: U8#2.3(RXD) ; port USART1_TX
NetU7_69: U8#2.2(TXD) ; port USART1_RX

Not connected (* = marked no-connect by the designer): U8#2 9(CTS#) 10(DSR#) 11(RI#) 12(DCD#) 15(R232); USB_1 4(NC)

### Notes on the sheet
- Boot1 = 0 Boot0 = 0 User Flash memory Normal
- Boot1 = 0 Boot0 = 1 System memory
- 一键下载

### Library data of the parts
C35 C36 = C
D9 D10 = 1N4148: 高速开关二极管
Q5 = MMBT3904: NPN Switching Transistor; Published: 17-Sep-2003; LatestRevisionDate: 12-Dec-2006; LatestRevisionNote: IPC-7351 Footprint Added.; DatasheetVersion: 13-May-2002; PackageVersion: May-1999; PackageReference: SOT23; Publisher: Altium Limited; PackageDescription: 3-Pin SOT-23 Package 0.95 mm Pitch, 2.3 mm Lead Span; ComponentLink1Description: Manufacturer Link; ComponentLink1URL: http://www.semiconductors.philips.com/; ComponentLink2Description: Datasheet; ComponentLink2URL: http://www.semiconductors.philips.com/acrobat/datasheets/MMBT3904_4.pdf
Q6 = MMBT3906: PNP Switching Transistor; Published: 17-Sep-2003; LatestRevisionDate: 12-Dec-2006; LatestRevisionNote: IPC-7351 Footprint Added.; DatasheetVersion: 11-Apr-2000; PackageVersion: May-1999; PackageReference: SOT23; Publisher: Altium Limited; PackageDescription: 3-Pin SOT-23 Package 0.95 mm Pitch, 2.3 mm Lead Span; ComponentLink1Description: Manufacturer Link; ComponentLink1URL: http://www.semiconductors.philips.com/; ComponentLink2Description: Datasheet; ComponentLink2URL: http://www.semiconductors.philips.com/acrobat/datasheets/MMBT3906_2.pdf
R49 R53 = CMP-1013-00623-1: as R42 on sheet CPU; Tolerance: 1 %; Power: 0.125 W; Technology: SMT
R50-R52 = CMP-1013-00510-1: as R41 on sheet CPU; Tolerance: 1 %; Power: 0.125 W; Technology: SMT
U8#2 = CH340G: USB2UART
USB_1 = USB5
Y4 = XTAL: Crystal Oscillator; Published: 8-Jun-2000; LatestRevisionDate: 17-Jul-2002; LatestRevisionNote: Re-released for DXP Platform.; Publisher: Altium Limited

## Sheet LM2596.SchDoc
size A4
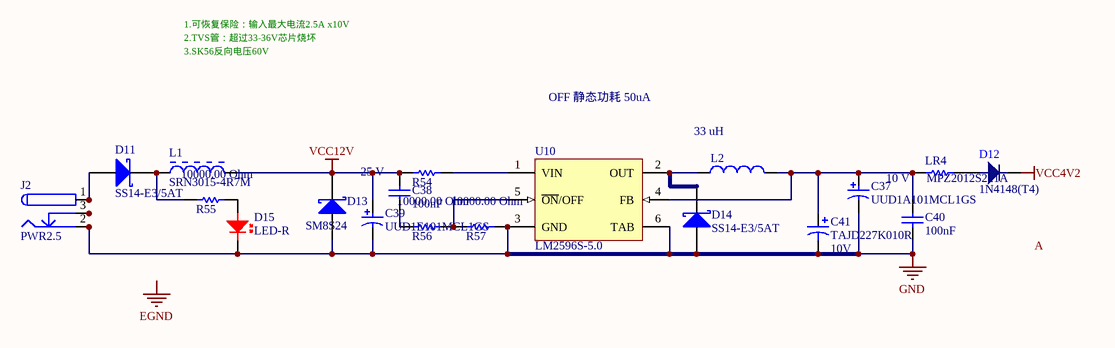
[diagram p7: LM2596.SchDoc]

### Parts
C37  UUD1A101MCL1GS  Rated Voltage: 10 V  [NIC-CAPA2-6.3X5.8_V]
C38  value 100nF  [CAPC0805(2012)100_L]  (hidden comment: CAP 100nF 50V 0805(2012))
C39  UUD1E101MCL1GS  Rated Voltage: 25 V  [NIC-CAPA2-6.3X7.7_V]
C40  value 100nF  [CAPC0805(2012)100_L]  (hidden comment: CAP 100nF 50V 0805(2012))
C41  TAJD227K010R  Rated Voltage: 10V  [AVX-CAPC7343_V]
D11  SS14-E3/5AT  [VISH-DO-214AC-2_V]
D12  1N4148(T4)  [SOD-123]
D13  SM8S24  [DIODE_SMC]
D14  SS14-E3/5AT  [VISH-DO-214AC-2_V]
D15  LED-R  [DIO-LIG]
J2  PWR2.5  [KLD-0202]
L1  SRN3015-4R7M  [BOUR-SRN3015-2_V]
L2  Inductance: 33 uH  [INDP5050X28N]  (hidden comment: SLF7045T-330M1R1-H)
LR4  MPZ2012S221A  [2012[0805]]
R54  2R 1% 0805(2012)  [RESC0805(2012)_L]  (value not drawn)
R55  value 10000.00 Ohm  [RESC0805(2012)_M]  (hidden comment: 10K 1% 0805(2012))
R56  value 10000.00 Ohm  [RESC0805(2012)_M]  (hidden comment: 10K 1% 0805(2012))
R57  value 10000.00 Ohm  [RESC0805(2012)_M]  (hidden comment: 10K 1% 0805(2012))
U10  LM2596S-5.0  [TS5B_N]

### Nets
GND: C37.2 C39.2 C40.1 C41.2 D13.1(A) D14.1(A) D15.2 J2.2 J2.2A J2.2B R57.2 U10.3(GND) U10.6(TAB)
VCC4V2: D12.2
VCC12V: C38.2 C39.1 D13.2(K) L1.2 R54.1
NetC37_1: C37.1 C40.2 C41.1 L2.2 LR4.1 U10.4(FB)
NetC38_1: C38.1 R56.1
NetD11_1: D11.1(A) J2.1 J2.1A J2.1B
NetD11_2: D11.2(K) L1.1 R55.1
NetD12_1: D12.1 LR4.2
NetD14_2: D14.2(K) L2.1 U10.2(OUT)
NetD15_1: D15.1 R55.2
NetJ2_3: J2.3 J2.3A J2.3B
NetR54_2: R54.2 U10.1(VIN)
NetR56_2: R56.2 R57.1 U10.5(~{ON}/OFF)

### Notes on the sheet
- 1.可恢复保险：输入最大电流2.5A x10V
- 2.TVS管：超过33-36V芯片烧坏
- 3.SK56反向电压60V
- OFF 静态功耗 50uA
- Labels drawn without touching a wire or pin: A, EGND

### Library data of the parts
C37 = CMP-0687-00054-1: Aluminum Electrolytic Capacitor, UD Series, Low Impedance, 100 uF, 10 V, + / - 20%, -55 to 105 degC, Chip Type, 6.3 x 5.8 mm D x L, Pb-Free, Reel; Manufacturer: Nichicon; Endurance Time: 2000 h; Packing: Dia382mm Reel; Tolerance Rated Capacitance: -20 to 20%; Rated Capacitance: 100 uF; Impedance: 0.44 Ohm; Rated Ripple Current (at 100kHz): 230 mA; ComponentLink1Description: Manufacturer URL; RoHS: TRUE; ComponentLink2Description: Datasheet; PackageReference: CAPAE-D6.3H5.8; Length: 5.8 mm; DatasheetVersion: 08/2012; ComponentLink3URL: http://products.nichicon.co.jp/en/pdf/XJA043/e-ud.pdf; ComponentLink1URL: http://www.nichicon.co.jp/; ComponentLink2URL: http://products.nichicon.co.jp/en/pdf/XJA043/e-ud.pdf; PartNumber: UUD1A101MCL1GS; PackageDescription: 2-Pin Surface Mount Device, Diameter 6.3 mm, Height 5.8 mm, Pitch 5.4 mm; ComponentLink3Description: Package Specification; Mounting Technology: Surface Mount; Diameter: 6.3 mm
C38 C40 = CMP-1036-04418-1: as C26 on sheet CPU; Tolerance: ±5%; Max Thickness: 1 mm; Technology: SMT; Rated Voltage: 50 V
C39 = CMP-0687-00063-1: Aluminum Electrolytic Capacitor, UD Series, Low Impedance, 100 uF, 25 V, + / - 20%, -55 to 105 degC, Chip Type, 6.3 x 7.7 mm D x L, Pb-Free, Reel; Manufacturer: Nichicon; Rated Ripple Current (at 100kHz): 280 mA; Endurance Time: 2000 h; Packing: Dia382mm Reel; Tolerance Rated Capacitance: -20 to 20%; Impedance: 0.34 Ohm; Rated Capacitance: 100 uF; PackageReference: CAPAE-D6.3H7.7; RoHS: TRUE; PackageDescription: 2-Pin Surface Mount Device, Diameter 6.3 mm, Height 7.7 mm, Pitch 5.4 mm; Mounting Technology: Surface Mount; ComponentLink3Description: Package Specification; Diameter: 6.3 mm; DatasheetVersion: 08/2012; PartNumber: UUD1E101MCL1GS; ComponentLink3URL: http://products.nichicon.co.jp/en/pdf/XJA043/e-ud.pdf; Length: 7.7 mm; ComponentLink2Description: Datasheet; ComponentLink2URL: http://products.nichicon.co.jp/en/pdf/XJA043/e-ud.pdf; ComponentLink1Description: Manufacturer URL; ComponentLink1URL: http://www.nichicon.co.jp/
C41 = CMP-0279-00002-1: Capacitor, Tantalum, 220uF 10% 10V MCCT-D (7343-31); Manufacturer: AVX; Polarity: Polarized; ComponentLink2URL: http://www.avx.com/docs/Catalogs/taj.pdf; PackageReference: CAPC7343; ComponentLink2Description: Datasheet; ComponentLink1URL: http://www.avx.com/; Mounting Technology: Surface Mount; PartNumber: TAJD227K010R; Technology: Tantalum; Tolerance: 10%; Capacitance: 220uF; PackageDescription: 2-Pin SMT Capacitor, 7.3 x 4.3 mm Body; ComponentLink1Description: Manufacturer URL; DatasheetVersion: Jul-13
D11 D14 = CMP-0549-00004-1: Schottky Barrier Rectifier, 40 V Maximum DC Blocking Voltage, -65 to 125 degC, 2-Pin SMA Case, RoHS; Manufacturer: Vishay Semiconductor; IFSM: 40 A; IF(AV): 1 A Max.; VRRM: 40 V Max.; VRMS: 28 V Max.; PackageReference: DO-214AC-2; RoHS: TRUE; DatasheetVersion: 12/17/2012; ComponentLink1Description: Manufacturer URL; ComponentLink2URL: http://www.vishay.com/docs/88746/ss12.pdf; PartNumber: SS14-E3/5AT; PackageVersion: Dec-12; Operating Temperature: -65 to 125 degC; ComponentLink3URL: http://www.vishay.com/docs/88746/ss12.pdf; PackageDescription: 2-Pin SMD, Body 4.245 x 2.665 mm, Height 2.29 mm; ComponentLink1URL: http://www.vishay.com/; ComponentLink3Description: Package Specification; ComponentLink2Description: Datasheet; Mounting Technology: Surface Mount; VDC: 40 V Max.
D12 = 1N4148: 高速开关二极管
D13 = 30BQ040: TVS
D15 = LED-RED: 红色LED
J2 = PWR2.5: Low Voltage Power Supply Connector; Published: 17-Dec-2003; DatasheetDocument: 09-May-2002; Publisher: Altium Limited; ComponentLink1Description: Manufacturer Link; ComponentLink1URL: http://domino.kycon.com/internet/Products.html
L1 = CMP-0007-00005-1: Semi-shielded Power Inductor, 4.7 uH, +/- 20%, 1.4 A, -40 to 125 degC, 3 x 3 x 1.5 mm SMD, RoHS and Halogen Free, Tape and Reel; Manufacturer: Bourns; SRF Min: 65 MHz; Inductance: 4.7 uH; Isat: 1.2 A; Resistance to Solder Heat: +260 degC for 10 sec.; Rated current: 1.4 A; Inductance tolerance: +/- 20%; DCR Max: 0.136 Ohm; RoHS: TRUE; ComponentLink2Description: Datasheet; PackageDescription: 2-Pin SMD, Body 3 x 3 mm, Height 1.5 mm; ComponentLink2URL: http://www.bourns.com/data/global/pdfs/SRN3015.pdf; ComponentLink1URL: http://www.bourns.com/; Packing: Tape and Reel; Mounting Technology: Surface Mount; ComponentLink3URL: http://www.bourns.com/data/global/pdfs/SRN3015.pdf; PackageReference: SRN3015; Operating Temperature: -40 to 125 degC; DatasheetVersion: Aug-11; ComponentLink1Description: Manufacturer URL; ComponentLink3Description: Package Specification; PartNumber: SRN3015-4R7M
L2 = Inductor: 固定电感器 SMD Power Inductor; Manufacturer: TDK; Core Material: Ferrite; Maximum DC Current: 1.1 A; Maximum DC Resistance: 96 mOhms; Shielding: Shielded; Tolerance: 20 %; Type: Wound Ferrite Inductor for Power Circuits; Case Height: 4.5 mm; Case Length: 7 mm; Test Frequency: 100 kHz; Supplier 1: Mouser; Supplier Part Number 1: 810-SLF7045T330M1R1H; Manufacturer Part Number: SLF7045T-330M1R1-H; RoHS: RoHS Compliant; Category: Fixed Inductors; Stock 1: 17; Pricing 1: 1=1.84, 10=1.38, 100=1.06, 500=0.780, 1000=0.734, 2000=0.689, 10000=0.666, 25000=0.643 (AUD); Operating Temperature Range: - 40 C to + 105 C; Package / Case: 7045 metric; Packaging: Reel; Product: Power Inductors; Series: SLF; Termination Style: SMD/SMT; Brand: TDK; Case Width: 7 mm; Product Category: Magnetic Shielded SMD Inductors; Standard Pack Qty: 1000; RoHS - Mouser: Y; Minimum Order Quantity: 1; Reeling: True; ComponentLink1URL: http://www.mouser.com/catalog/specsheets/tdk_e531_slf.pdf; ComponentLink1Description: http://www.mouser.com/catalog/specsheets/tdk_e531_slf.pdf
LR4 = Res Semi: as LR1 on sheet CPU; Supplier 1: Mouser; Supplier Part Number 1: 810-MPZ2012S221A; Manufacturer Part Number: MPZ2012S221A; RoHS: RoHS Compliant; Description 1: 电磁干扰滤波珠子、扼流圈和阵列 Ferrite Chip Beads; Category: 电磁干扰滤波珠子、扼流圈和阵列; Stock 1: 26540; Pricing 1: 1=0.070, 50=0.060, 100=0.053, 500=0.040, 1000=0.035, 4000=0.031, 8000=0.029, 12000=0.025 (USD); 制造商: TDK; RoHS - 贸泽: Y; Minimum Order Quantity: 1; Reeling: True; ComponentLink1URL: http://www.mouser.com/ds/2/400/e9413_mpz-24582.pdf; ComponentLink1Description: http://www.mouser.com/ds/2/400/e9413_mpz-24582.pdf
R54 = CMP-1013-00203-1: 2R 0.125W 1% 0805 (2012 Metric)  SMD; Case-EIA: 0805; Value: 2.00 Ohm; Case-Metric: 2012; Tolerance: 1 %; Power: 0.125 W; Technology: SMT
R55-R57 = CMP-1013-00623-1: as R42 on sheet CPU; Tolerance: 1 %; Power: 0.125 W; Technology: SMT
U10 = LM2596S-5.0: SIMPLE SWITCHER?Power Converter 150 KHz 3A Step-Down Voltage Regulator, 5-pin TO-263; Manufacturer: National Semiconductor; PackageTopMarking: NSUZXYTTE#*LM2596S*-5.0 P+; PowerWise: N; High-Reliability: Y; DatasheetVersion: May-2002; PackageVersion: revD, Apr-2005; PackageReference: TS5B; PackageDescription: TO-263, Molded, .400 x .390 x .180in, 5 Lead, .067in Pitch, Surface Mount; PartNumber: LM2596S-5.0; RoHS: N; PinCount: 5; CompType: Switcher; Code_JEDEC: MO-169-AB; ComponentLink1Description: Manufacturer URL; ComponentLink1URL: http://www.national.com/; ComponentLink2Description: LM2596 Datasheet; ComponentLink2URL: http://www.national.com/ds/LM/LM2596.pdf; ComponentLink3Description: LM2596 Web Page; ComponentLink3URL: http://www.national.com/pf/LM/LM2596.html; ComponentLink4Description: TS5B Package Page; ComponentLink4URL: http://www.national.com/packaging/folders/ts5b.html